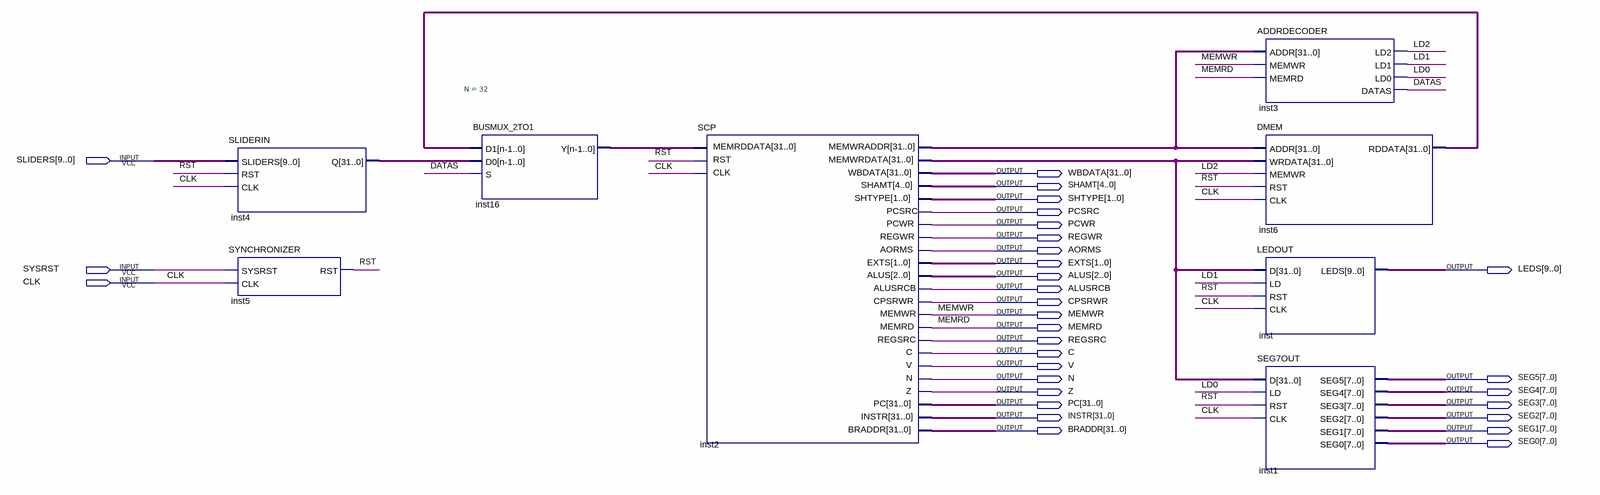
[diagram p0: schematic sheet]
// Quartus schematic SYSTEM.bdf as structural Verilog: 8 symbols, 31 pins
module SYSTEM (
  input  [9:0] SLIDERS,
  input  SYSRST,
  input  CLK,
  output [31:0] WBDATA,
  output [4:0] SHAMT,
  output [1:0] SHTYPE,
  output PCSRC,
  output PCWR,
  output REGWR,
  output AORMS,
  output [1:0] EXTS,
  output [9:0] LEDS,
  output [2:0] ALUS,
  output ALUSRCB,
  output CPSRWR,
  output MEMWR,
  output MEMRD,
  output REGSRC,
  output C,
  output V,
  output N,
  output [7:0] SEG5,
  output Z,
  output [7:0] SEG4,
  output [31:0] PC,
  output [7:0] SEG3,
  output [31:0] INSTR,
  output [7:0] SEG2,
  output [31:0] BRADDR,
  output [7:0] SEG1,
  output [7:0] SEG0
);

  wire DATAS, LD0, LD1, LD2, RST;
  wire [31:0] inst2_memwraddr, inst2_memwrdata, inst4_q, inst6_rddata, inst16_y;

  SLIDERIN inst4 (.SLIDERS(SLIDERS), .RST(RST), .CLK(CLK), .Q(inst4_q));
  SYNCHRONIZER inst5 (.SYSRST(SYSRST), .CLK(CLK), .RST(RST));
  BUSMUX_2TO1 #(.N(32)) inst16 (.D1(inst6_rddata), .D0(inst4_q), .S(DATAS), .Y(inst16_y));
  SCP inst2 (
    .MEMRDDATA(inst16_y), .RST(RST), .CLK(CLK), .MEMWRADDR(inst2_memwraddr), .MEMWRDATA(inst2_memwrdata),
    .WBDATA(WBDATA), .SHAMT(SHAMT), .SHTYPE(SHTYPE), .PCSRC(PCSRC), .PCWR(PCWR), .REGWR(REGWR),
    .AORMS(AORMS), .EXTS(EXTS), .ALUS(ALUS), .ALUSRCB(ALUSRCB), .CPSRWR(CPSRWR), .MEMWR(MEMWR),
    .MEMRD(MEMRD), .REGSRC(REGSRC), .C(C), .V(V), .N(N), .Z(Z), .PC(PC), .INSTR(INSTR), .BRADDR(BRADDR));
  ADDRDECODER inst3 (
    .ADDR(inst2_memwraddr), .MEMWR(MEMWR), .MEMRD(MEMRD), .LD2(LD2), .LD1(LD1), .LD0(LD0), .DATAS(DATAS));
  DMEM inst6 (
    .ADDR(inst2_memwraddr), .WRDATA(inst2_memwrdata), .MEMWR(LD2), .RST(RST), .CLK(CLK), .RDDATA(inst6_rddata));
  LEDOUT inst (.D(inst2_memwrdata), .LD(LD1), .RST(RST), .CLK(CLK), .LEDS(LEDS));
  SEG7OUT inst1 (
    .D(inst2_memwrdata), .LD(LD0), .RST(RST), .CLK(CLK), .SEG5(SEG5), .SEG4(SEG4), .SEG3(SEG3), .SEG2(SEG2),
    .SEG1(SEG1), .SEG0(SEG0));
endmodule
